# EasyEDA Pro project original-v2.epro, board PCB1
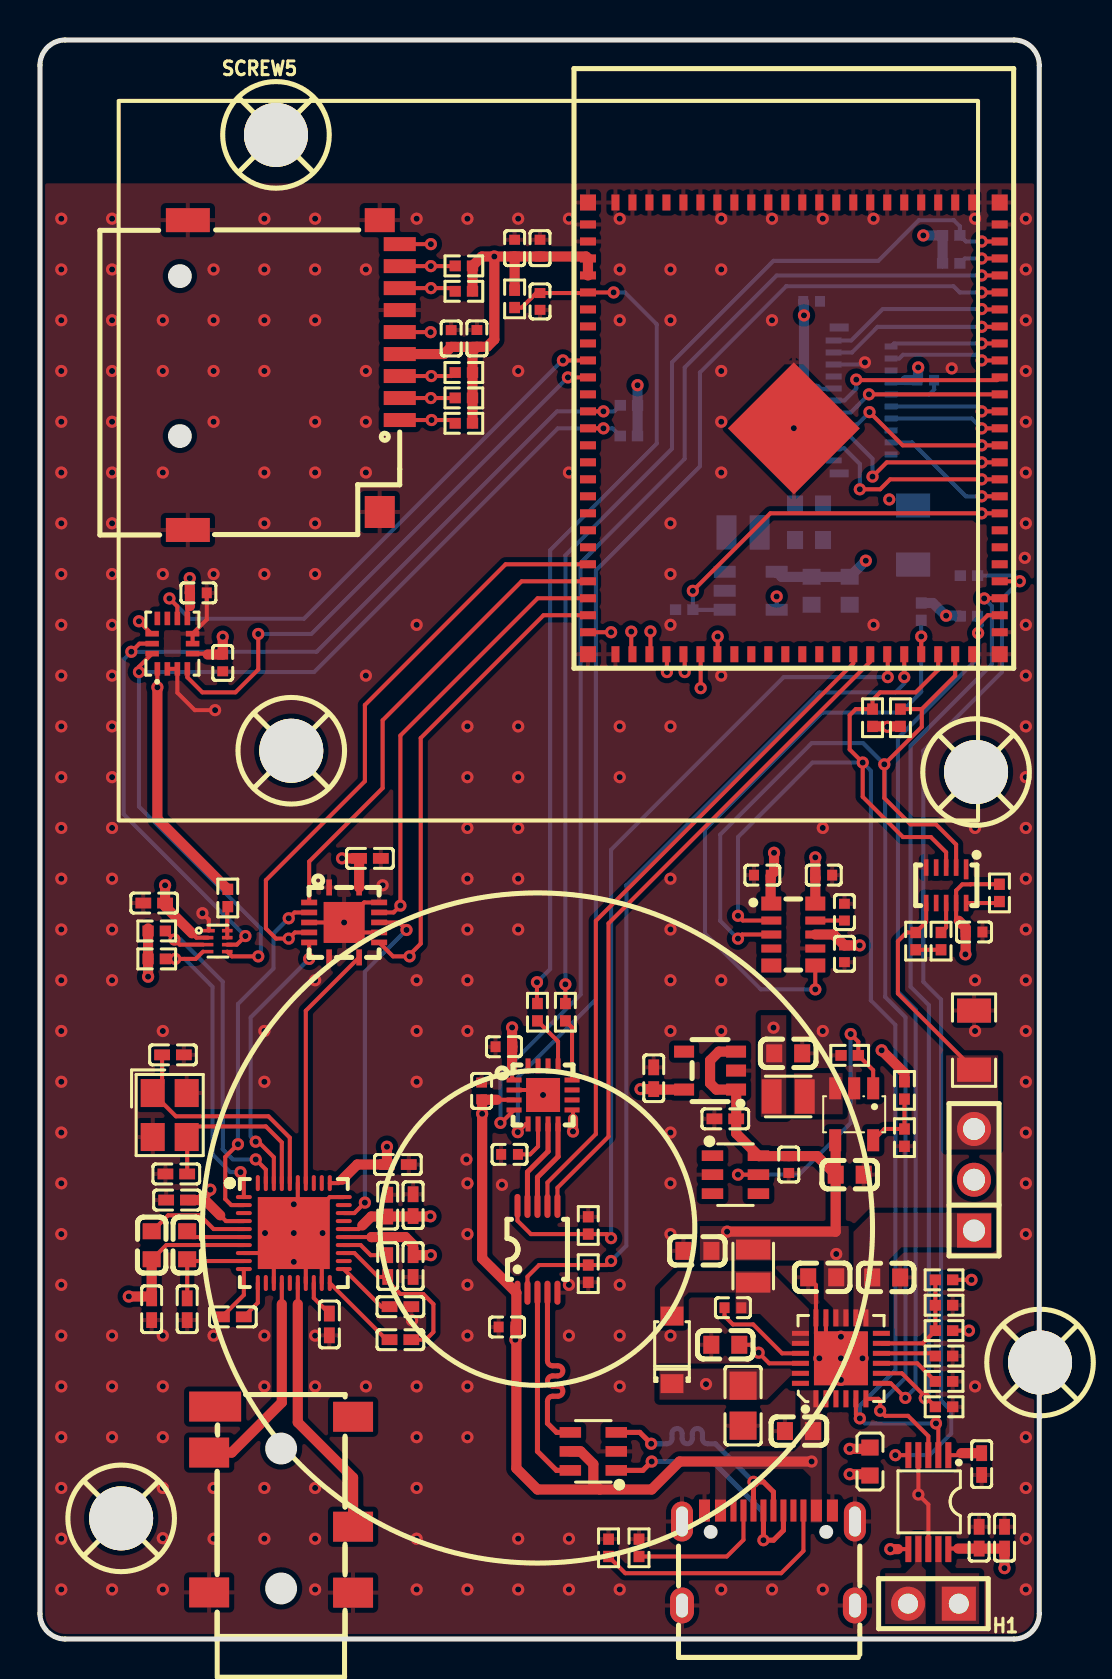
[diagram p9: board, top side]
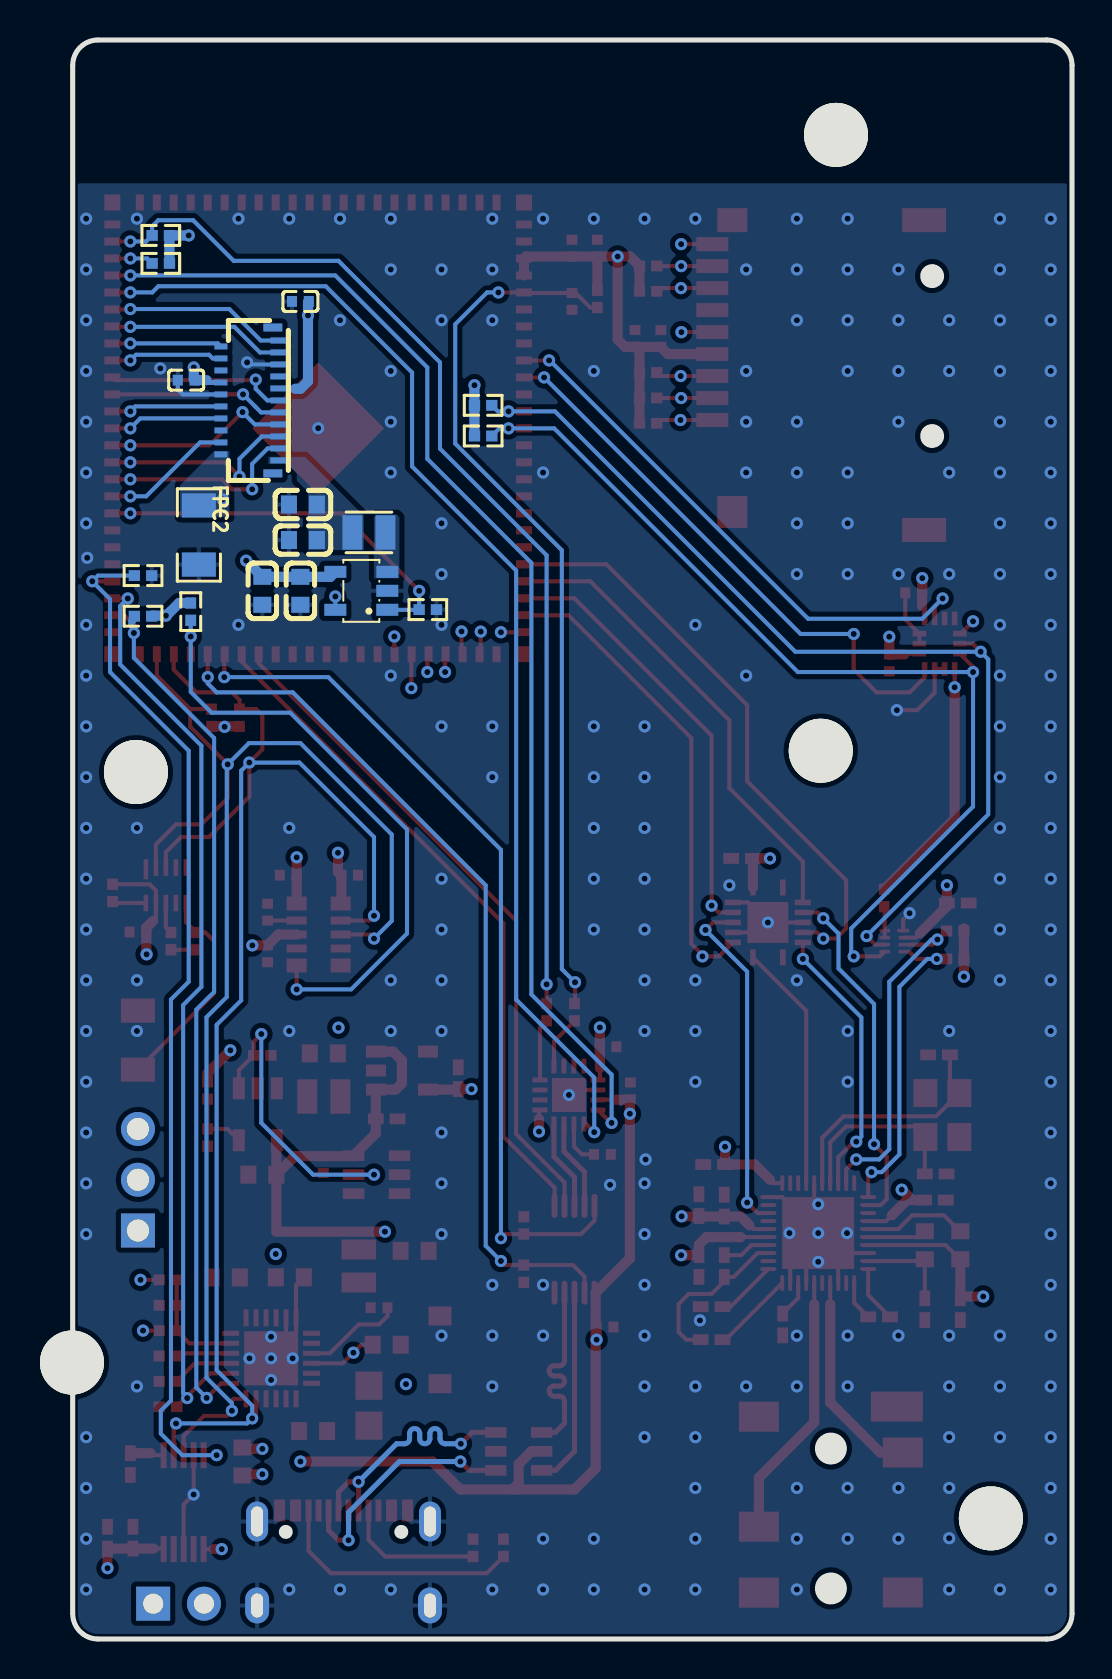
[diagram p10: board, bottom side, seen from below]

Outline 50 x 80 mm; copper layers: Top Layer, GND1, PWR, SINGAL, GND2, Bottom Layer. Coordinates in mm from the lower left corner of the outline.
Outline path: 0,78.73 0,1.27 arc(0.37,0.37) 1.27,0 48.73,0 arc(49.63,0.37) 50,1.27 50,78.73 arc(49.63,79.63) 48.73,80 1.27,80 arc(0.37,79.63) 0,78.73
Stack: Top Layer 0.035mm Outer layer thickness 1oz / Dielectric1 0.0994mm 3313 RC57% 4.2mil / GND1 0.035mm / Dielectric2 0.55mm 0.55mm H/H No copper / PWR 0.035mm / Dielectric3 0.1088mm 2116 RC54% 4.9mil / SINGAL 0.035mm / Dielectric4 0.55mm 0.55mm H/H No copper / GND2 0.035mm / Dielectric5 0.0994mm 3313 RC57% 4.2mil / Bottom Layer 0.035mm Outer layer thickness 1oz

## Design rules (mm)
net TYPEC_USB_DP_IN: USB1
net TYPEC_USB_DN_IN: USB1
net TYPEC_USB_DN: USB2
net TYPEC_USB_DP: USB2
net CH343P_USB_DP: USB3
net CH343P_USB_DN: USB3
spacing copperThickness1oz (default): track to track 0.102, other pairs 0.152 to 0.3
spacing copperThickness2oz: track to track 0.203, other pairs 0.152 to 0.3
track width copperThickness1oz (default): min 0.127, default 0.203, max 2.54
track width copperThickness2oz: min 0.203, default 0.254, max 2.54
track width power: min 0.127, default 0.508, max 2.54
differential pair differentialPair (default): width min 0.127, default 0.254, max 2.54; gap min 0.152, default 0.152
net GND uses copperRegion
net VBAT uses power
net VCC uses power
net VCC_3V3 uses power
net VCC_1V8 uses power
net VBUS_5V uses power

## Placement (name value [footprint] x y rotation side)
C1  10uF  [C0603_1]  40.51 23.23 180 top
C2  10uF  [C0603_1]  37.44 29.3 180 top
C3  100nF  [C0402]  37.47 23.74 90 top
C4  1uF  [C0402_1]  47.12 8.75 90 top
C5  1uF  [C0402_1]  46.99 5.07 270 top
C6  100nF  [C0402]  36.14 38.22 180 top
C7  100nF  [C0402]  39.22 38.22 0 top
C8  22uF  [C0603]  5.59 19.7 270 top
C9  4.7uF  [C0603_1]  34.29 14.72 180 top
C10  10uF  [C0603_1]  42.34 18.09 180 top
C11  47nF  [C0402]  34.67 16.58 0 top
C12  10uF  [C0603_1]  32.89 19.42 0 top
C14  1uF  [C0603_1]  37.97 10.4 0 top
C15  10uF  [C0603_1]  39.14 18.1 0 top
C16  47uF  [C0805]  35.18 11.67 270 top
C17  2.2uF  [C0402_1]  5.59 16.5 270 top
C18  22uF  [C0603]  7.37 19.7 270 top
C19  2.2uF  [C0402_1]  7.37 16.5 270 top
C20  2.2uF  [C0402_1]  9.65 16.12 0 top
C21  2.2uF  [C0402_1]  18.03 16.63 0 top
C22  2.2uF  [C0402_1]  14.48 15.74 270 top
C23  2.2uF  [C0402_1]  18.67 18.66 90 top
C24  2.2uF  [C0402_1]  17.4 18.66 270 top
C25  2.2uF  [C0402_1]  18.03 14.98 0 top
C26  4.7uF  [C0402_1]  17.4 21.68 90 top
C27  100nF  [C0402_1]  17.91 23.74 0 top
C28  100nF  [C0402_1]  6.86 21.96 180 top
C29  100nF  [C0402_1]  18.67 21.71 90 top
C30  1uF  [C0402_1]  34.29 26.02 0 top
C31  1uF  [C0402_1]  30.71 28.06 270 top
C32  10pF  [C0402_1]  6.66 29.23 180 top
C33  10pF  [C0402_1]  6.82 23.27 180 top
C34  100nF  [C0402_1]  5.72 36.82 180 top
C35  100nF  [C0402_1]  16.51 39.05 180 top
C36  100nF  [C0402]  23.37 15.61 180 top
C37  100nF  [C0402]  23.22 29.63 180 top
C38  100nF  [C0402]  23.5 24.25 180 top
C39  1uF  [C0402]  25.02 66.92 270 top
C40  100nF  [C0402]  25.02 69.59 90 top
C41  1uF  [C0402]  23.75 69.59 90 top
C42  10uF  [C0603_1]  38.48 56.76 180 bottom
C43  220nF  [C0402]  46.74 35.37 0 top
C44  100nF  [C0402]  22.1 27.42 90 top
C45  100nF  [C0402]  44.32 62.98 0 bottom
C46  100nF  [C0402]  38.61 66.92 0 bottom
C47  100nF  [C0402]  9.14 48.83 270 top
C48  100nF  [C0402]  7.93 52.34 0 top
C49  10uF  [C0402]  20.57 65.06 270 top
C50  100nF  [C0402]  21.86 65.07 270 top
C53  100nF  [C0402]  40.25 34.28 270 top
C54  1uF  [C0402]  40.25 36.37 90 top
C55  10uF  [C0603_1]  38.48 54.98 180 bottom
C56  10uF  [C0603_1]  40.51 52.44 90 bottom
C57  10uF  [C0603_1]  38.61 52.44 90 bottom
C58  100nF  [C0402_1]  48.26 5.07 270 top
CARD2  TF PUSH  [TF-SMD_TF-PUSH]  12.7 63.24 270 top
CN1  PJ-342B-TX-SMT  [AUDIO-SMD_PJ-342B-TX-SMT]  12.06 6.97 90 top
D1  USBLC6-2SC6  [SOT-23-6_L2.9-W1.6-P0.95-LS2.8-BL]  27.69 9.39 90 top
D2  B5817W  [SOD-123_L2.8-W1.8-LS3.7-RD]  31.62 14.47 90 top
FPC2  2.09寸320*375高清R角方屏QSPI  [CONN-TH-21P_AFE03-S21FMA-1H]  41.15 61.97 90 bottom
H1  -  [HDR-TH_2P-P2.54-V-F]  44.7 1.77 180 top
H2  -  [HDR-TH_3P-P2.54-V-M]  46.74 22.98 90 top
L1  2.2uH  [IND-SMD_L2.0-W1.6]  37.44 27.14 0 top
L2  2.2uH  [IND-SMD_L2.0-W1.6]  35.69 18.66 270 top
L3  BLM18KG601SN1D  [L0603]  41.53 8.88 90 top
L4  4.7uH  [IND-SMD_L2.0-W1.6]  35.18 55.36 180 bottom
R1  10mΩ  [R1206]  46.74 29.96 90 top
R2  1K  [R0402]  48.01 37.33 90 top
R3  22K1  [R0402]  43.25 25.08 90 top
R4  100K  [R0402]  43.25 27.45 90 top
R5  100K  [R0402]  40.51 29.2 0 top
R7  10K  [R0402]  41.66 46.09 90 top
R8  10K  [R0402]  43.05 46.09 90 top
R9  700R  [R0402]  45.23 14.16 180 top
R10  0R/NC  [R0402]  45.23 17.97 180 top
R11  100K  [R0402]  45.23 12.89 180 top
R12  100K  [R0402]  45.23 11.62 180 top
R13  5K23  [R0402]  45.23 15.43 180 top
R14  30K1  [R0402]  45.23 16.7 180 top
R17  200K  [R0402_2]  9.4 37.07 90 top
R18  10K  [R0402_1]  5.84 35.42 180 top
R19  10K  [R0402_1]  5.84 34.03 180 top
R20  10K  [R0402]  45.59 70.22 0 bottom
R21  100K  [R0402]  27.43 20.69 270 top
R22  100K  [R0402]  27.43 18.28 270 top
R25  10K  [R0402]  45.59 68.82 0 bottom
R26  10K  [R0402]  29.47 61.72 180 bottom
R27  0/NC  [R0402]  24.89 31.36 90 top
R28  0/NC  [R0402]  26.29 31.36 270 top
R29  10K  [R0402]  23.75 67.05 90 top
R30  10K  [R0402]  29.46 60.19 180 bottom
R31  5K1  [R0402]  29.97 4.56 270 top
R32  5K1  [R0402]  28.45 4.56 270 top
R33  1K  [R0402]  45.09 34.91 270 top
R34  0R/NC  [R0402]  43.81 34.91 270 top
R35  10K  [R0402]  21.21 68.7 180 top
R36  10K  [R0402]  21.21 60.82 180 top
R37  10K  [R0402]  21.21 62.09 180 top
R38  10K  [R0402]  21.21 67.43 180 top
R39  10K  [R0402]  21.21 63.36 180 top
R40  1R5  [R1206]  43.69 55.23 90 bottom
R41  100K  [R0402]  32.23 51.5 0 bottom
R42  10K  [R0402]  44.09 51.4 90 bottom
R43  10K  [R0402]  46.48 51.17 0 bottom
R44  10K  [R0402]  46.48 53.2 0 bottom
SCREW1  -  [M3螺丝]  4.06 6.04 0 top
SCREW2  -  [M3螺丝]  12.57 44.44 0 top
SCREW3  -  [M3螺丝]  50.04 13.83 0 top
SCREW4  -  [M3螺丝]  46.84 43.37 0 top
SCREW5  -  [M3螺丝]  11.81 75.25 0 top
U1  RX8130CE:BB  [RTC-SMD_L3.2-W2.5-P0.7-RX8130CE]  37.69 35.25 0 top
U2  CS43131-CNZ  [QFN-40_L5.0-W5.0-P0.40-TL-EP3.6_1]  12.7 20.31 0 top
U3  BQ25895RTW  [WQFN-24_L4.0-W4.0-P0.50-TL-EP2.7]  40.07 14.04 90 top
U4  TLV62568DBVR  [SOT-23-5_L3.0-W1.7-P0.95-LS2.8-BR]  40.74 26.25 90 top
U5  ME6211C18M5G-N  [SOT-23-5_L3.0-W1.7-P0.95-LS2.8-BR_1]  33.53 28.44 0 top
U6  GEK100  [SOT-23-6_L2.9-W1.6-P0.95-LS2.8-BL-2]  34.8 23.23 270 top
U7  PCA9306DQER  [X2SON-8_L1.4-W1.0-P0.35-BL]  8.89 34.91 270 top
U8  SN74LV4T125RGYR  [VQFN-14_L3.5-W3.5-P0.50-BL-EP]  15.22 35.85 270 top
U9  ESP32-S31-WROOM-3-N16R16V  [CONN-SMD_ESP32-S31-WROOM-3]  37.72 60.57 0 top
U11  DRV2605LDGSR  [VSSOP-10_L3.0-W3.0-P0.50-LS4.9-BL]  44.45 6.85 180 top
U12  CH343P  [TQFN-16_L3.0-W3.0-P0.50-BL-EP1.7]  25.17 27.22 270 top
U14  STC3115AIQT  [DFN-10_L3.0-W2.0-P0.50-BL]  45.34 37.71 180 top
U15  LSM6DS3TR-C  [LGA-14_L3.0-W2.5-P0.50-TL]  6.62 49.8 90 top
U16  PAM2804AAB010  [SOT-23-5_L3.0-W1.7-P0.95-LS2.8-BR]  35.56 52.44 180 bottom
U17  SGM7229YMS10G/TR  [MSOP-10_L3.0-W3.0-P0.50-LS4.9-BL]  24.89 19.5 0 top
USB1  TYPE-C 16PIN 2MD(073)  [USB-C-SMD_TYPE-C-16PIN-2MD-073]  36.45 4.05 0 top
X1  26MHz  [CRYSTAL-SMD_4P-L3.2-W2.5-BL_1]  6.49 26.21 270 top

## Footprints (pads in the part's own frame, mm; a bottom-side part is the same pattern mirrored in y, then rotated)
AUDIO-SMD_PJ-342B-TX-SMT
  rect 1.5x2 smd: 2(-4.645,3.6) 3(2.355,3.6) 5(-4.655,-3.6) 6(-1.355,-3.6) 7(4.145,-3.6)
  rect 1.5x2.6 smd: 4(4.655,3.3)
C0402
  rect 0.5x0.54 smd: 1(-0.42,0) 2(0.42,0)
C0402_1
  rect 0.79x0.54 smd: 1(-0.545,0) 2(0.545,0)
C0603
  rect 0.8x0.9 smd: 1(-0.7,0) 2(0.7,0)
C0603_1
  rect 0.8x0.9 smd: 1(-0.7,0) 2(0.7,0)
C0805
  rect 1.41x1.35 smd: 1(-1,0) 2(1,0)
CONN-SMD_ESP32-S31-WROOM-3
  rect 0.8x0.4 smd: 1(-10.3,10.2) 2(-10.3,9.35) 3(-10.3,8.5) 4(-10.3,7.65) 5(-10.3,6.8) 6(-10.3,5.95) 7(-10.3,5.1) 8(-10.3,4.25) 9(-10.3,3.4) 10(-10.3,2.55) 11(-10.3,1.7) 12(-10.3,0.85) 13(-10.3,0) 14(-10.3,-0.85) 15(-10.3,-1.7) 16(-10.3,-2.55) 17(-10.3,-3.4) 18(-10.3,-4.25) 19(-10.3,-5.1) 20(-10.3,-5.95) 21(-10.3,-6.8) 22(-10.3,-7.65) 23(-10.3,-8.5) 24(-10.3,-9.35) 25(-10.3,-10.2) 48(10.3,-10.2) 49(10.3,-9.35) 50(10.3,-8.5) 51(10.3,-7.65) 52(10.3,-6.8) 53(10.3,-5.95) 54(10.3,-5.1) 55(10.3,-4.25) 56(10.3,-3.4) 57(10.3,-2.55) 58(10.3,-1.7) 59(10.3,-0.85) 60(10.3,0) 61(10.3,0.85) 62(10.3,1.7) 63(10.3,2.55) 64(10.3,3.4) 65(10.3,4.25) 66(10.3,5.1) 67(10.3,5.95) 68(10.3,6.8) 69(10.3,7.65) 70(10.3,8.5) 71(10.3,9.35) 72(10.3,10.2)
  rect 0.4x0.8 smd: 26(-8.925,-11.3) 27(-8.075,-11.3) 28(-7.225,-11.3) 29(-6.375,-11.3) 30(-5.525,-11.3) 31(-4.675,-11.3) 32(-3.825,-11.3) 33(-2.975,-11.3) 34(-2.125,-11.3) 35(-1.275,-11.3) 36(-0.425,-11.3) 37(0.425,-11.3) 38(1.275,-11.3) 39(2.125,-11.3) 40(2.975,-11.3) 41(3.825,-11.3) 42(4.675,-11.3) 43(5.525,-11.3) 44(6.375,-11.3) 45(7.225,-11.3) 46(8.075,-11.3) 47(8.925,-11.3) 73(8.925,11.3) 74(8.075,11.3) 75(7.225,11.3) 76(6.375,11.3) 77(5.525,11.3) 78(4.675,11.3) 79(3.825,11.3) 80(2.975,11.3) 81(2.125,11.3) 82(1.275,11.3) 83(0.425,11.3) 84(-0.425,11.3) 85(-1.275,11.3) 86(-2.125,11.3) 87(-2.975,11.3) 88(-3.825,11.3) 89(-4.675,11.3) 90(-5.525,11.3) 91(-6.375,11.3) 92(-7.225,11.3) 93(-8.075,11.3) 94(-8.925,11.3)
  custom 6.604x6.604 smd: 95(0,3.302)
  rect 0.8x0.8 smd: 96(-10.3,-11.3) 97(10.3,-11.3) 98(10.3,11.3) 99(-10.3,11.3)
CONN-TH-21P_AFE03-S21FMA-1H
  rect 0.3x0.8 smd: 1(-3,-1.438) 3(-2.4,-1.438) 5(-1.8,-1.438) 7(-1.2,-1.438) 9(-0.6,-1.438) 11(0,-1.438) 13(0.6,-1.438) 15(1.2,-1.438) 17(1.8,-1.438) 19(2.4,-1.438) 21(3,-1.438)
  rect 0.3x0.65 smd: 2(-2.7,1.438) 4(-2.1,1.438) 6(-1.5,1.438) 8(-0.9,1.438) 10(-0.3,1.438) 12(0.3,1.438) 14(0.9,1.438) 16(1.5,1.438) 18(2.1,1.438) 20(2.7,1.438)
  rect 0.4x0.95 smd: 22(3.65,-1.163) 23(-3.65,-1.163)
CRYSTAL-SMD_4P-L3.2-W2.5-BL_1
  rect 1.4x1.2 smd: 1(-1.1,-0.85) 2(1.1,-0.85) 3(1.1,0.85) 4(-1.1,0.85)
DFN-10_L3.0-W2.0-P0.50-BL
  rect 0.23x1 smd: 1(-1,-0.8)
  rect 0.23x0.825 smd: 2(-0.5,-0.887) 3(0,-0.887) 4(0.5,-0.887) 5(1,-0.887) 6(1,0.887) 7(0.5,0.887) 8(0,0.887) 9(-0.5,0.887) 10(-1,0.887)
HDR-TH_2P-P2.54-V-F
  rect 1.7x1.7 hole 1: 1(-1.27,0)
  round 1.7 hole 1: 2(1.27,0)
HDR-TH_3P-P2.54-V-M
  rect 1.7x1.7 hole 1.1: 1(-2.54,0)
  round 1.7 hole 1.1: 2(0,0) 3(2.54,0)
IND-SMD_L2.0-W1.6
  rect 1x1.72 smd: 1(0.828,0) 2(-0.828,0)
L0603
  rect 0.8x0.864 smd: 1(-0.7,0) 2(0.7,0)
LGA-14_L3.0-W2.5-P0.50-TL
  rect 0.675x0.28 smd: 1(-1.262,0.75) 2(-1.262,0.25) 3(-1.262,-0.25) 4(-1.262,-0.75) 8(1.262,-0.75) 9(1.262,-0.25) 10(1.262,0.25) 11(1.262,0.75)
  rect 0.28x0.675 smd: 5(-0.5,-1.012) 6(0,-1.012) 7(0.5,-1.012) 12(0.5,1.012) 13(0,1.012) 14(-0.5,1.012)
M3螺丝
  round 3.2 hole 3.2: 1(0,0)
MSOP-10_L3.0-W3.0-P0.50-LS4.9-BL
  oval 0.3x1.2 smd: 1(-1,-2.17) 2(-0.5,-2.17) 3(0,-2.17) 4(0.5,-2.17) 5(1,-2.17) 6(1,2.17) 7(0.5,2.17) 8(0,2.17) 9(-0.5,2.17) 10(-1,2.17)
QFN-40_L5.0-W5.0-P0.40-TL-EP3.6_1
  oval 0.8x0.2 smd: 1(-2.499,1.8) 2(-2.499,1.4) 3(-2.499,1) 4(-2.499,0.6) 5(-2.499,0.2) 6(-2.499,-0.2) 7(-2.499,-0.6) 8(-2.499,-1) 9(-2.499,-1.4) 10(-2.499,-1.8) 21(2.499,-1.8) 22(2.499,-1.4) 23(2.499,-1) 24(2.499,-0.6) 25(2.499,-0.2) 26(2.499,0.2) 27(2.499,0.6) 28(2.499,1) 29(2.499,1.4) 30(2.499,1.8)
  oval 0.2x0.8 smd: 11(-1.8,-2.499) 12(-1.4,-2.499) 13(-1,-2.499) 14(-0.6,-2.499) 15(-0.2,-2.499) 16(0.2,-2.499) 17(0.6,-2.499) 18(1,-2.499) 19(1.4,-2.499) 20(1.8,-2.499) 31(1.8,2.499) 32(1.4,2.499) 33(1,2.499) 34(0.6,2.499) 35(0.2,2.499) 36(-0.2,2.499) 37(-0.6,2.499) 38(-1,2.499) 39(-1.4,2.499) 40(-1.8,2.499)
  rect 3.6x3.6 smd: 41(0,0)
R0402
  rect 0.566x0.54 smd: 1(-0.433,0) 2(0.433,0)
R0402_1
  rect 0.566x0.54 smd: 1(-0.433,0) 2(0.433,0)
R0402_2
  rect 0.566x0.54 smd: 1(-0.433,0) 2(0.433,0)
R1206
  rect 1.208x1.701 smd: 1(-1.479,0) 2(1.479,0)
RTC-SMD_L3.2-W2.5-P0.7-RX8130CE
  rect 1x0.7 smd: 1(-1.1,1.55) 5(-1.1,-1.55) 6(1.1,-1.55) 10(1.1,1.55)
  rect 1x0.4 smd: 2(-1.1,0.7) 3(-1.1,0) 4(-1.1,-0.7) 7(1.1,-0.7) 8(1.1,0) 9(1.1,0.7)
SOD-123_L2.8-W1.8-LS3.7-RD
  rect 0.95x1.15 smd: 1(-1.692,0) 2(1.692,0)
SOT-23-5_L3.0-W1.7-P0.95-LS2.8-BR
  rect 1.1x0.6 smd: 1(1.3,-0.95) 2(1.3,0) 3(1.3,0.95) 4(-1.3,0.95) 5(-1.3,-0.95)
SOT-23-5_L3.0-W1.7-P0.95-LS2.8-BR_1
  rect 1x0.6 smd: 1(1.3,-0.95) 2(1.3,0) 3(1.3,0.95) 4(-1.3,0.95) 5(-1.3,-0.95)
SOT-23-6_L2.9-W1.6-P0.95-LS2.8-BL
  rect 0.532x1.072 smd: 1(-0.95,-1.149) 2(0,-1.149) 3(0.95,-1.149) 4(0.95,1.149) 5(0,1.149) 6(-0.95,1.149)
SOT-23-6_L2.9-W1.6-P0.95-LS2.8-BL-2
  rect 0.532x1.072 smd: 1(-0.95,-1.149) 2(0,-1.149) 3(0.95,-1.149) 4(0.95,1.149) 5(0,1.149) 6(-0.95,1.149)
TF-SMD_TF-PUSH
  rect 0.7x1.6 smd: 1(2.25,5.3) 2(1.15,5.3) 3(0.05,5.3) 4(-1.05,5.3) 5(-2.15,5.3) 6(-3.25,5.3) 7(-4.35,5.3) 8(-5.45,5.3) CD(-6.55,5.3)
  rect 1.2x1.5 smd: 10(-7.75,4.3)
  rect 1.2x2.2 smd: 11(-7.75,-5.3) 12(7.75,-5.3)
  rect 1.6x1.5 smd: 13(6.85,4.3)
TQFN-16_L3.0-W3.0-P0.50-BL-EP1.7
  rect 0.25x0.75 smd: 1(-0.749,-1.45) 2(-0.248,-1.45) 3(0.252,-1.45) 4(0.751,-1.45) 9(0.75,1.45) 10(0.25,1.45) 11(-0.25,1.45) 12(-0.749,1.45)
  rect 0.75x0.25 smd: 5(1.45,-0.75) 6(1.45,-0.25) 7(1.45,0.25) 8(1.45,0.75) 13(-1.45,0.75) 14(-1.45,0.25) 15(-1.45,-0.25) 16(-1.45,-0.75)
  rect 1.7x1.7 smd: 17(0.001,0)
USB-C-SMD_TYPE-C-16PIN-2MD-073
  oval 1.1x2 hole 0.6x1.5: 13(-4.325,1.825) 14(4.325,1.825)
  oval 1.2x1.8 hole 0.6x1.2: 13(-4.325,-2.375) 14(4.325,-2.375)
  rect 0.55x1.1 smd: A1B12(-3.2,2.375) A4B9(-2.4,2.375) B1A12(3.2,2.375) B4A9(2.4,2.375)
  rect 0.3x1.1 smd: A5(-1.25,2.375) A6(-0.25,2.375) A7(0.25,2.375) A8(1.25,2.375) B5(1.75,2.375) B6(0.75,2.375) B7(-0.75,2.375) B8(-1.75,2.375)
VQFN-14_L3.5-W3.5-P0.50-BL-EP
  rect 0.8x0.28 smd: 1(-1.75,-0.75) 7(1.75,-0.75) 8(1.75,0.75) 14(-1.75,0.75)
  rect 0.28x0.8 smd: 2(-0.999,-1.75) 3(-0.498,-1.75) 4(0.002,-1.75) 5(0.501,-1.75) 6(1.002,-1.75) 9(1,1.75) 10(0.5,1.75) 11(0,1.75) 12(-0.5,1.75) 13(-1,1.75)
  rect 2.05x2.05 smd: 15(0,0)
VSSOP-10_L3.0-W3.0-P0.50-LS4.9-BL
  rect 0.3x1.3 smd: 1(-1,-2.35) 2(-0.5,-2.35) 3(0,-2.35) 4(0.5,-2.35) 5(1,-2.35) 6(1,2.35) 7(0.5,2.35) 8(0,2.35) 9(-0.5,2.35) 10(-1,2.35)
WQFN-24_L4.0-W4.0-P0.50-TL-EP2.7
  rect 0.85x0.25 smd: 1(-2.025,1.25) 2(-2.025,0.75) 3(-2.025,0.25) 4(-2.025,-0.25) 5(-2.025,-0.75) 6(-2.025,-1.25) 13(2.025,-1.25) 14(2.025,-0.75) 15(2.025,-0.25) 16(2.025,0.25) 17(2.025,0.75) 18(2.025,1.25)
  rect 0.25x0.85 smd: 7(-1.25,-2.025) 8(-0.75,-2.025) 9(-0.25,-2.025) 10(0.25,-2.025) 11(0.75,-2.025) 12(1.25,-2.025) 19(1.25,2.025) 20(0.75,2.025) 21(0.25,2.025) 22(-0.25,2.025) 23(-0.75,2.025) 24(-1.25,2.025)
  rect 2.7x2.7 smd: 25(0.001,0)
X2SON-8_L1.4-W1.0-P0.35-BL
  rect 0.175x0.6 smd: 1(-0.525,-0.445)
  rect 0.175x0.53 smd: 2(-0.175,-0.48) 3(0.175,-0.48) 4(0.525,-0.48) 5(0.525,0.48) 6(0.175,0.48) 7(-0.175,0.48) 8(-0.525,0.48)

## Nets
As in the schematic, except:
$2N16: C9.1 R13.1 U3.22
$2N18: R10.2 R13.2 R14.2 U3.11

Pads without a net: CN1 4 7; FPC2 6 15 16 22 23; SCREW1 1; SCREW2 1; SCREW3 1; SCREW4 1; SCREW5 1; U1 4 5; U2 3 12 15 22 27 29 32 33 40; U5 4; U6 4; U9 6 7 8 33 34 35 36 37 38 39 52 53 54 91; U12 10 11 14 15 16; U14 4 7; U15 10 11; USB1 A8 B8

## Via types
v1: diameter 0.61, hole 0.305, Top Layer to Bottom Layer, 364 vias

## Routing (per net, layer and track width the routed paths; a pad name or vN(x,y) marks a point on that pad's centre or on a via; arc(x,y) is an arc through that point)
GND: length 43
  Top Layer w0.203: U2.13 11.7,19.31 U2.8 ; 12.9,20.51 v1(12.7,20.31) ; 12.9,20.51 14.5,22.11 U2.30 ; 12.9,20.51 U2.35 ; v1(8.13,36.31) 8.44,35.99 8.44,35.44 ; U15.2 U15.3 6.87,47.34 7.75,46.47 v1(8.76,46.47) ; v1(25.17,27.22) 24.92,27.47 U12.2 ; C15.1 38.82,17.71 U3.18 38.82,15.29 39.32,14.79 ; U15.6 U15.7 8.34,51.01 C48.2 ; U2.17 13.3,19.71 14.1,18.91 U2.19 ; 39.32,14.79 v1(40.08,14.04) ; 39.32,14.79 U3.17 ; U11.8 44.45,6.73 v1(43.95,7.23) U11.4 ; 13.47,35.85 v1(15.22,35.85) ; U8.13 16.22,36.85 U8.15 15.72,35.35 U8.10
  Bottom Layer w0.203: FPC2.17 41.17,63.77 v1(41.28,63.87) ; FPC2.12 44.5,62.27 44.74,62.51 44.74,62.85
  vias: v1(1.07,71.06) v1(1.07,68.52) v1(1.07,65.98) v1(1.07,63.44) v1(1.07,60.9) v1(1.07,58.36) v1(1.07,55.82) v1(1.07,53.28) v1(1.07,50.74) v1(1.07,48.2) v1(1.07,45.66) v1(1.07,43.12) v1(1.07,40.58) v1(1.07,38.04) v1(1.07,35.5) v1(1.07,32.96) v1(1.07,30.42) v1(1.07,27.88) v1(1.07,25.34) v1(1.07,22.8) v1(1.07,20.26) v1(1.07,17.72) v1(1.07,15.18) v1(1.07,12.64) v1(1.07,10.1) v1(1.07,7.56) v1(1.07,5.02) v1(1.07,2.48) v1(3.61,71.06) v1(3.61,68.52) v1(3.61,65.98) v1(3.61,63.44) v1(3.61,60.9) v1(3.61,58.36) v1(3.61,55.82) v1(3.61,53.28) v1(3.61,50.74) v1(3.61,48.2) v1(3.61,45.66) v1(3.61,43.12) v1(3.61,40.58) v1(3.61,38.04) v1(3.61,35.5) v1(3.61,32.96) v1(3.61,15.18) v1(3.61,12.64) v1(3.61,10.1) v1(3.61,2.48) v1(6.15,65.98) v1(6.15,63.44) v1(6.15,58.36) v1(6.15,53.28) v1(6.15,30.42) v1(6.15,15.18) v1(6.15,12.64) v1(6.15,10.1) v1(6.15,7.56) v1(6.15,5.04) v1(6.15,2.48) v1(8.69,68.52) v1(8.69,65.98) v1(8.69,63.44) v1(8.69,60.9) v1(8.69,53.28) v1(8.69,15.18) v1(8.69,7.56) v1(8.69,5.02) v1(11.23,71.06) v1(11.23,68.52) v1(11.23,65.98) v1(11.23,63.44) v1(11.23,58.36) v1(11.23,55.82) v1(11.23,53.28) v1(11.23,30.42) v1(11.23,27.88) v1(11.26,20.31) v1(11.23,15.18) v1(11.23,12.64) v1(11.23,7.56) v1(11.23,5.02) v1(12.7,21.75) v1(12.7,18.87) v1(13.77,71.06) v1(13.77,68.52) v1(13.77,65.98) v1(13.77,60.9) v1(13.77,58.36) v1(13.77,55.82) v1(13.77,53.28) v1(13.77,32.96) v1(13.77,15.18) v1(13.77,12.64) v1(13.77,7.56) v1(13.77,5.02) v1(13.77,2.48) v1(14.14,20.31) v1(16.31,68.52) v1(16.31,63.44) v1(16.31,60.9) v1(16.31,58.36) v1(16.31,48.2) v1(16.31,12.64) v1(17.15,37.71) v1(18.62,15.94) v1(18.85,71.06) v1(18.85,50.74) v1(18.85,32.96) v1(18.85,30.42) v1(18.85,27.88) v1(18.85,12.64) v1(18.85,10.1) v1(18.85,7.56) v1(18.85,5.02) v1(18.85,2.48) v1(21.34,23.99) v1(21.39,71.06) v1(21.39,45.66) v1(21.39,43.12) v1(21.39,40.58) v1(21.39,38.04) v1(21.39,35.5) v1(21.39,32.96) v1(21.39,30.42) v1(21.39,22.8) v1(21.39,20.26) v1(21.39,17.72) v1(21.39,15.18) v1(21.39,12.64) v1(21.39,10.1) v1(21.39,2.48) v1(23.11,22.72) v1(23.93,71.06) v1(23.93,63.44) v1(23.93,45.66) v1(23.93,43.12) v1(23.93,40.58) v1(23.93,38.04) v1(23.93,35.5) v1(23.93,5.02) v1(23.93,2.48) v1(26.47,71.06) v1(26.47,58.36) v1(26.47,17.72) v1(26.47,15.18) v1(26.47,5.02) v1(26.47,2.48) v1(29.01,71.06) v1(29.01,68.52) v1(29.01,65.98) v1(29.01,45.66) v1(29.01,43.12) v1(29.01,17.72) v1(29.01,15.18) v1(29.01,12.64) v1(29.01,2.48) v1(31.55,68.52) v1(31.55,65.98) v1(31.55,55.82) v1(31.55,53.28) v1(31.55,50.74) v1(31.55,45.66) v1(31.55,38.04) v1(31.55,35.5) v1(31.55,32.96) v1(31.55,30.42) v1(31.55,25.34) v1(31.55,22.8) v1(31.55,20.26) v1(31.55,15.18) v1(34.09,71.06) v1(34.09,68.52) v1(34.09,63.44) v1(34.09,60.9) v1(34.09,58.36) v1(34.09,48.2) v1(34.09,32.96) v1(34.09,30.42) v1(34.09,2.48) v1(36.63,71.06) v1(36.63,65.98) v1(36.63,2.48) v1(37.72,60.58) v1(39,14.04) v1(39.17,71.06) v1(39.17,40.58) v1(39.17,30.42) v1(39.17,2.48) v1(40.08,15.12) v1(40.07,12.96) v1(41.16,14.04) v1(41.71,71.06) v1(41.71,50.74) v1(45.62,63.57) v1(46.79,71.06) v1(46.79,40.58) v1(46.79,32.96) v1(46.79,30.42) v1(46.79,12.64) v1(49.33,71.06) v1(49.33,68.52) v1(49.33,65.98) v1(49.33,63.44) v1(49.33,60.9) v1(49.33,58.36) v1(49.33,55.82) v1(49.28,54.09) v1(49.33,50.74) v1(49.33,48.2) v1(49.33,45.66) v1(49.33,43.12) v1(49.33,40.58) v1(49.33,38.04) v1(49.33,35.5) v1(49.33,32.96) v1(49.33,30.42) v1(49.33,27.88) v1(49.33,25.34) v1(49.33,22.8) v1(49.33,20.26) v1(49.33,10.1) v1(49.33,7.56) v1(49.33,5.02) v1(49.33,2.48)
VBAT: length 33.6
  Top Layer w0.203: R2.2 46.56,37.76 46.56,37.76 46.15,37.76 45.84,37.45 U14.9 45.84,36.07 45.97,35.93
  Top Layer w0.508: 45.97,35.93 46.32,35.59 46.32,35.42 ; C43.1 46.32,34.27 v1(46.3,34.25) ; 38.79,38.05 v1(38.79,39.11) ; 38.79,38.05 U1.10 ; 38.79,38.05 38.81,38.07
  PWR w0.508: 44.45,32.4 44.45,33.45 v1(38.79,39.11) ; 44.45,32.4 44.45,20.94 44.96,20.44 H2.1 ; 44.45,32.4 v1(46.3,34.25)
VBUS_5V: length 47.7
  Top Layer w0.203: U12.9 26.67,26.42 26.67,26.02 ; 22.86,26.98 23.71,26.98 U12.3
  Top Layer w0.508: 28,7.48 24.89,7.48 23.84,8.54 23.84,17.33 22.12,19.04 v1(22.12,26.28) 22.12,26.98 22.86,26.98 ; 28,7.48 27.69,7.8 27.69,8.75 27.05,9.39 D1.5 ; 28,7.48 30.61,7.48 32,8.88 v1(38.61,8.88) ; 26.67,26.02 v1(26.67,25.39) ; C36.1 v1(23.79,14.98)
  PWR w0.508: v1(22.12,26.28) 22.12,24.98 22.73,24.37 25.78,24.37 26.67,25.26 v1(26.67,25.39)
VCC: length 41.9
  Top Layer w0.203: 16.13,20.69 15.95,20.51 U2.26
  Top Layer w0.508: C1.2 39.81,20.38 v1(34.38,20.38) ; C1.2 38.88,24.16 C3.2 35.97,24.16 U6.6 34.84,25.29 C30.2 34.84,27.48 U5.1 33.84,27.49 33.53,27.8 33.53,28.95 33.97,29.39 U5.3 ; C1.2 39.81,24.93 U4.4 ; 16.13,20.69 16.57,21.14 C26.1 19.52,21.14 v1(19.53,21.15)
  PWR w0.508: v1(19.53,21.15) 33.61,21.15 v1(34.38,20.38)
  vias: v1(39.84,19.26)
VCC_1V8: length 109.8
  Top Layer w0.203: 7.61,35.31 7.83,35.09 U7.2 ; 5.59,18.97 6.32,19.71 U2.7 ; 15.11,22.98 14.95,22.81 U2.31 ; U2.25 16.59,20.11 ; 9.02,21.2 9.31,20.91 U2.4
  Top Layer w0.508: v1(4.45,17.13) 5.5,17.13 C17.1 5.59,18.97 ; 7.61,35.31 6.26,36.66 C34.1 v1(6.26,37.71) ; 16.59,20.11 16.59,20.11 18.29,20.11 18.67,19.73 C23.2 v1(19.56,19.2) ; 15.11,22.98 15.88,23.74 C27.1 v1(17.36,24.63) ; 8,21.96 8.25,21.96 9.02,21.2 ; 8,21.96 v1(8.52,22.48) ; 8,21.96 C28.1 ; v1(30.05,27.51) C31.2 30.73,27.49 U5.5 ; 5.41,33.14 5.41,35.55 ; v1(15.11,39.05) C35.2 15.97,39.05 U8.14
  PWR w0.508: v1(8.52,22.48) 15.22,22.48 v1(17.36,24.63) ; v1(15.11,39.05) 7.61,39.05 v1(6.26,37.71) 5.41,36.86 v1(5.41,33.14) 4.01,31.74 4.01,17.57 v1(4.45,17.13) 12.95,17.13 15.14,19.33 ; v1(19.56,19.2) 15.27,19.2 15.14,19.33 ; v1(17.36,24.63) 21.3,28.56 29,28.56 v1(30.05,27.51) ; v1(17.36,24.63) 17.36,21.54 15.14,19.33
VCC_3V3: length 229.1
  Top Layer w0.203: U15.5 8.25,49.3 ; v1(4.95,50.92) 5.57,50.3 U15.12 ; U15.8 7.37,51.55 7.5,51.68 ; 23.62,28.56 23.62,28.07 U12.1 ; U15.1 v1(5.87,47.61)
  Top Layer w0.508: v1(36.73,39.33) 36.73,38.38 C6.1 ; U1.1 36.56,36.83 36.56,38.14 ; v1(7.49,53.08) 7.49,52.35 7.5,52.34 7.5,51.68 ; 23.62,29.62 v1(23.62,30.6) ; 23.62,29.62 C37.1 ; 23.62,29.62 23.62,28.56 ; R7.1 R8.1 ; U9.4 U9.3 27.32,69.17 C40.1 C41.1 ; v1(22.73,69.17) 22.11,69.17 R35.1 R38.1 ; v1(22.73,69.17) C41.1 ; v1(22.73,69.17) 22.73,65.01 22.37,64.65 C50.2 ; CARD2.4 20.22,64.29 C49.2 21.86,64.64 21.64,64.43 R39.1 R37.1 R36.1 ; 8.39,49.25 C47.1 v1(9.14,50.14) ; R4.2 43.25,28.31 v1(42.11,29.45) ; U1.8 39.71,35.25 C53.1 v1(41.01,34.7) ; v1(5.87,47.61) 5.87,41.03 R17.2 ; C41.1 R29.2
  PWR w0.508: v1(22.73,69.17) 23.46,69.17 v1(29.9,62.73) ; v1(22.73,69.17) 20.1,66.54 16.26,66.54 7.49,57.77 v1(7.49,53.08) 7.49,51.62 5.87,50 ; v1(22.73,69.17) 23.79,70.22 v1(44.2,70.22) 44.2,68.95 41.47,66.22 41.34,66.22 ; 5.87,50 v1(4.95,50.92) ; 5.87,50 v1(5.87,47.61) ; v1(42.11,29.45) 42.11,33.6 v1(41.01,34.7) 36.73,38.99 v1(36.73,39.33) 36.7,39.31 ; 41.34,66.22 v1(38.23,66.22) ; 41.34,66.22 v1(43.94,63.62) 45.38,62.18 45.38,46.17 43.56,46.17 43.03,45.64 v1(42.4,45.64) 38.54,45.64 36.7,43.8 36.7,39.31 ; v1(36.7,30.59) 36.7,39.31 ; v1(5.87,47.61) 5.87,43.77 8.38,41.26 16.76,41.26 23.62,34.41 v1(23.62,30.6) ; v1(5.87,47.61) 6.62,47.61 v1(9.14,50.14)
  Bottom Layer w0.203: 38.86,62.55 39.69,62.55 FPC2.13
  Bottom Layer w0.254: 43.31,62.98 43.19,62.87 FPC2.14
  Bottom Layer w0.508: R25.1 R20.1 v1(44.2,70.22) ; C46.1 38.23,66.88 v1(38.23,66.22) 38.23,62.93 38.6,62.55 38.86,62.55 ; R30.1 29.9,60.19 R26.1 v1(29.9,62.73) ; R42.2 44.68,51.83 45.31,51.2 v1(45.34,51.2) 46.02,51.2 R43.1 ; 43.31,62.98 43.9,62.98 43.94,63.02 v1(43.94,63.62)
VCC_LCD_BG: length 61.4
  Top Layer w0.508: v1(40.51,9.51) 41.46,9.51 L3.2
  PWR w0.508: v1(41.32,53.95) 32.89,45.52 32.89,30.34 35.81,27.42 35.81,16.63 33.33,14.14 v1(33.33,12.75) 35.8,10.28 39.75,10.28 v1(40.51,9.51)
  Bottom Layer w0.508: U16.4 37.11,53.14 C57.2 C56.2 v1(41.32,53.95)
BAT_TS: length 8.6
  Top Layer w0.203: R10.1 v1(46.61,17.97)
  SINGAL w0.203: H2.2 45.97,22.98 44.83,21.83 44.83,18.53 45.39,17.97 v1(46.61,17.97)
BQ25895_CHG_EN#: length 3.1
  Top Layer w0.203: R11.2 43.9,13.79 U3.9
BQ25895_I2C_CLK: length 71.2
  Top Layer w0.203: v1(44.83,10.78) 44.95,10.67 U11.2 ; U3.5 40.82,11.23 v1(41.02,11.04) ; U1.2 35.16,35.95 v1(34.93,36.18) ; U9.45 44.94,48.49 43.81,47.36 42.04,47.36 41.66,46.98 R7.2 40.82,46.52 40.51,46.22 40.51,44.5 v1(41.16,43.85) 41.16,42.14 43.18,40.12 44.58,40.12 45.34,39.36 U14.3
  Bottom Layer w0.203: v1(44.83,10.78) 41.28,10.78 v1(41.02,11.04) 41.02,11.67 42.8,13.45 42.8,30.72 41.57,31.95 41.57,43.44 v1(41.16,43.85) 38.65,43.85 34.93,40.12 v1(34.93,36.18)
BQ25895_I2C_SDA: length 71.8
  Top Layer w0.203: v1(34.93,35.04) 35.13,35.25 U1.3 ; U3.6 41.95,12.02 42.04,11.93 v1(42.04,11.42) 42.29,11.17 43.43,11.17 44.45,10.15 U11.3 ; R8.2 44.12,46.52 ; 44.12,46.52 44.12,45.63 v1(42.25,43.76) 42.25,42.07 43.56,40.76 44.83,40.76 45.84,39.75 U14.2 ; 44.12,46.52 45.79,48.2 U9.46
  Bottom Layer w0.203: v1(34.93,35.04) 34.04,35.93 34.04,40.25 38.61,44.82 41.19,44.82 v1(42.25,43.76) 42.29,43.71 42.29,32.12 43.31,31.1 43.31,13.07 42.04,11.8 v1(42.04,11.42)
BQ25895_INT: length 44.8
  Top Layer w0.203: U9.49 47.42,51.22 46.94,50.74 v1(46.94,50.33) ; v1(43.3,12.06) 42.57,12.79 U3.7
  Bottom Layer w0.203: 47.04,51.04 47.12,50.97 47.12,50.71 ; 47.12,50.71 46.91,50.92 ; 47.12,50.71 46.94,50.54 v1(46.94,50.33) 46.94,49.09 42.93,45.07 42.93,32.37 43.81,31.49 43.81,12.58 v1(43.3,12.06)
BQ25895_OTG_EN: length 46.5
  Top Layer w0.203: v1(47.24,52.06) 47.25,52.07 U9.50 ; R12.2 43.13,13.29 U3.8
  Bottom Layer w0.203: v1(44.27,12.05) 44.27,12.09 44.48,12.29 44.48,31.71 43.56,32.63 43.56,44.69 47.62,48.76 47.62,51.68 v1(47.24,52.06)
CH343P_UART_DTR: length 3.1
  Top Layer w0.203: U12.12 26.62,30.59 R28.2
CH343P_UART_RTS: length 2.7
  Top Layer w0.203: U12.13 25.92,29.9 R27.1
CH343P_UART_RX: length 59.4
  Top Layer w0.203: U12.5 24.32,25.77 v1(23.91,25.36) ; U9.68 v1(47.12,67.37)
  Bottom Layer w0.203: v1(47.12,67.37) 46.02,67.37 45.71,67.68 37.34,67.68 33.02,63.36 33.02,58.66 27.81,53.46 27.81,31.99 23.91,28.09 v1(23.91,25.36)
CH343P_UART_TX: length 60.2
  Top Layer w0.203: U9.69 v1(47.12,68.22) ; v1(23.04,25.82) 23.08,25.82 U12.4
  Bottom Layer w0.203: v1(23.04,25.82) 23.04,28.23 27.05,32.25 27.05,53.84 32.26,59.04 32.26,63.62 36.86,68.22 v1(47.12,68.22)
CH343P_USB_DN: length 4.5
  Top Layer w0.254: U12.8 25.92,24.13 24.89,23.1 U17.8
CH343P_USB_DP: length 4.5
  Top Layer w0.254: U17.9 24.39,23.37 25.42,24.4 U12.7
CS43131_I2S_LRCK: length 13.8
  Top Layer w0.203: U2.38 11.7,24.1 10.92,24.88 v1(10.79,24.88) ; U8.6 v1(13.47,34.03)
  Bottom Layer w0.203: v1(13.47,34.03) 10.54,31.1 10.54,25.14 v1(10.79,24.88)
CS43131_I2S_SCLK: length 12.4
  Top Layer w0.203: U8.8 13.3,31.43 U2.34
CS43131_I2S_SDIN: length 17.6
  Top Layer w0.203: U2.2 9.57,21.71 9.27,22.01 9.27,24.12 v1(9.91,24.75) ; 13.47,36.35 12.74,36.35 v1(12.45,36.06)
  Bottom Layer w0.203: v1(12.45,36.06) 11.68,35.3 11.68,33.55 9.91,31.77 v1(9.91,24.75)
CS43131_RST#_1V8: length 17.3
  Top Layer w0.203: v1(18.34,35.47) 17.96,35.85 U8.11 ; v1(16.26,21.83) 15.73,21.31 U2.28
  Bottom Layer w0.203: v1(16.26,21.83) 16.26,33.39 v1(18.34,35.47)
CS43131_SCL_1V8: length 17.1
  Top Layer w0.203: 8.16,34.74 6.99,34.74 v1(6.73,34.99) 6.7,34.99 R18.1 ; U2.39 11.3,23.49 v1(10.79,23.99)
  Bottom Layer w0.203: v1(6.73,34.99) 7.03,34.99 9.14,32.88 9.14,24.5 9.65,23.99 v1(10.79,23.99)
CS43131_SDA_1V8: length 15.9
  Top Layer w0.203: U2.1 10.2,23.19 v1(10.03,23.36) ; 8.16,34.39 7.79,34.03 v1(6.77,34.03) R19.1
  Bottom Layer w0.203: v1(6.77,34.03) 7.24,34.03 8.64,32.63 8.64,24.25 9.53,23.36 v1(10.03,23.36)
DAC_I2C_SCL: length 49.5
  Top Layer w0.203: v1(4.57,49.39) 4.98,49.8 U15.13 ; v1(10.28,35.17) 9.85,34.74 U7.6 ; 27.42,61.42 v1(28.19,61.42)
  Bottom Layer w0.203: R26.2 28.73,61.42 v1(28.19,61.42) 25.87,61.42 13.84,49.39 v1(4.57,49.39) 4.19,49.01 4.19,41.26 v1(10.28,35.17)
DAC_I2C_SDA: length 49.7
  Top Layer w0.203: U15.14 4.95,48.64 v1(4.95,48.38) ; U9.13 v1(28.19,60.57) ; U7.5 9.61,34.15 v1(10.92,34.15)
  Bottom Layer w0.203: v1(10.92,34.15) 11.05,34.28 11.05,35.55 4.95,41.65 v1(4.95,48.38) 13.72,48.38 25.91,60.57 v1(28.19,60.57) 28.65,60.57 R30.2
DAC_I2S_LRCK: length 29.8
  Top Layer w0.203: U9.21 23.3,53.77 16.26,46.73 16.26,42.92 11.3,37.96 11.3,35.55 11.81,35.04 v1(12.45,35.04) 12.75,35.35 13.47,35.35
DAC_I2S_SCLK: length 23.9
  Top Layer w0.203: U8.9 17.67,34.15 v1(18.49,34.15) 18.49,34.23 19.05,34.79 19.05,45.07 25.19,51.22 U9.24
DAC_I2S_SDIN: length 23.8
  Top Layer w0.203: 13.47,36.85 13.47,38.89 17.15,42.57 17.15,45.96 24.1,52.92 27.42,52.92
DAC_RST#: length 21.9
  Top Layer w0.203: U9.23 24.9,52.07 18.03,45.2 v1(18.03,36.69) 17.69,36.35 U8.12
ESP32S31_EN: length 44.6
  Top Layer w0.203: v1(28.7,67.37) U9.5 27.39,67.34 24.83,67.34 24.1,66.61 R29.1 ; R27.2 24.87,31.82 v1(24.87,32.86)
  Bottom Layer w0.203: v1(28.7,67.37) 29.27,67.37 30.86,65.78 30.86,59.81 25.53,54.47 25.53,33.52 v1(24.87,32.86)
ESP_BOOT1: length 54.3
  Top Layer w0.203: R28.1 v1(26.29,32.76) ; 48.02,69.92 v1(47.12,69.92)
  Bottom Layer w0.203: v1(47.12,69.92) 46.33,69.92 R20.2 46.03,70.68 45.72,70.98 43.98,70.98 41.94,68.95 36.7,68.95 31.62,63.87 31.62,59.55 26.29,54.22 v1(26.29,32.76)
ESP_BOOT2: length 2.1
  Top Layer w0.203: U9.70 v1(47.12,69.07)
  Bottom Layer w0.203: R25.2 46.27,69.07 v1(47.12,69.07)
ESP_I2C2_SCL: length 8.8
  Top Layer w0.203: U9.66 48,65.65 v1(47.12,65.65)
  Bottom Layer w0.203: v1(47.12,65.65) 41.91,65.65 40.63,64.37 FPC2.19
ESP_I2C2_SDA: length 5.5
  Top Layer w0.203: U9.65 v1(47.12,64.82)
  Bottom Layer w0.203: v1(47.12,64.82) 42.74,64.82 FPC2.20
ESP_IO1: length 27.9
  Top Layer w0.203: U9.9 v1(26.17,63.97) ; U15.9 6.87,51.66 v1(6.48,52.06)
  Bottom Layer w0.203: v1(26.17,63.97) 26.13,63.97 13.21,51.04 7.49,51.04 v1(6.48,52.06)
ESP_IO4: length 28.3
  Top Layer w0.203: v1(10.92,50.28) 10.92,48.5 9.78,47.36 8.13,47.36 7.37,48.11 U15.4 ; U9.10 v1(26.42,63.12)
  Bottom Layer w0.203: v1(10.92,50.28) 13.58,50.28 v1(26.42,63.12)
ESP_IO19: length 26.5
  Top Layer w0.203: U9.25 v1(28.57,50.37) ; CARD2.CD v1(19.56,69.79)
  SINGAL w0.203: v1(28.57,50.37) 21.34,57.61 21.34,64.76 18.8,67.3 18.8,69.02 v1(19.56,69.79)
ESP_IO33: length 43.8
  Top Layer w0.203: U17.10 23.89,20.93 24.56,20.26 R21.2 28.37,20.26 v1(28.57,20.06) ; U9.42 42.42,49.24 v1(42.42,48.12)
  Bottom Layer w0.203: v1(28.57,20.06) 28.57,39.49 37.21,48.12 v1(42.42,48.12)
ESP_IO34: length 44
  Top Layer w0.203: 24.39,17.33 24.39,18.13 24.97,18.71 R22.1 28.37,18.71 v1(28.57,18.91) ; U9.43 v1(43.24,48.12)
  Bottom Layer w0.203: v1(28.57,18.91) 29.34,19.67 29.34,37.71 38.99,47.36 42.8,47.36 43.24,47.81 v1(43.24,48.12)
ESP_IO35: length 31.2
  Top Layer w0.203: U1.6 v1(38.79,32.5) ; U9.44 v1(44.09,50.15)
  Bottom Layer w0.203: 44.09,50.97 v1(44.09,50.16) 44.09,47.39 43.05,46.34 39.12,46.34 33.27,40.5 33.27,35.3 36.07,32.5 v1(38.79,32.5)
ESP_IO40: length 52.3
  Top Layer w0.203: 48.02,52.92 v1(49.02,52.92) ; U11.5 v1(42.8,9.2)
  Bottom Layer w0.203: v1(42.8,9.2) 44.51,9.2 45.59,10.28 45.59,11.42 45.09,11.93 45.09,31.99 44.2,32.88 44.2,44.44 48.13,48.38 48.13,52.03 v1(49.02,52.92) 48.74,53.2 R44.2
ESP_IO45: length 19.5
  Top Layer w0.203: U9.55 v1(47.12,56.32) 36.54,56.32 v1(32.67,52.44)
  Bottom Layer w0.203: U16.1 32.68,51.49 R41.2 v1(32.67,52.44)
ESP_IO46: length 6.6
  Top Layer w0.203: U9.56 v1(47.12,57.17)
  Bottom Layer w0.203: v1(47.12,57.17) 46.33,57.17 43.63,59.87 FPC2.4
ESP_IO47: length 10.1
  Top Layer w0.203: U9.57 v1(47.12,58.02) 42.53,58.02 42.04,57.52 v1(41.02,57.52)
  Bottom Layer w0.203: FPC2.3 40.25,59.57 41.02,58.79 v1(41.02,57.52)
ESP_IO54: length 5.6
  Top Layer w0.203: U9.64 v1(47.12,63.97)
  Bottom Layer w0.203: v1(47.12,63.97) 46.83,64.25 43.18,64.25 42.99,64.07 FPC2.18
ESP_IO57: length 9
  Top Layer w0.203: U9.67 47.14,66.52 v1(47.12,66.54)
  Bottom Layer w0.203: FPC2.21 40.59,64.97 42.16,66.54 v1(47.12,66.54)
ESP_SPI2_CLK: length 10
  Top Layer w0.203: U9.58 v1(47.12,58.87) 42.37,58.87 v1(41.66,58.16)
  Bottom Layer w0.203: v1(41.66,58.16) 41.66,59.04 40.53,60.17 FPC2.5
ESP_SPI2_CS: length 9.3
  Top Layer w0.203: v1(41.5,61.38) 43.17,59.72 v1(47.12,59.72) U9.59
  Bottom Layer w0.203: v1(41.5,61.38) 40.89,60.77 FPC2.7
ESP_SPI2_D0: length 9.1
  Top Layer w0.203: U9.63 47.88,62.98 40.87,62.98 v1(40.84,63.01)
  Bottom Layer w0.203: FPC2.11 40.26,61.97 40.84,62.55 v1(40.84,63.01)
ESP_SPI2_D1: length 5.5
  Top Layer w0.203: 48.02,61.42 v1(47.12,61.42)
  Bottom Layer w0.203: v1(47.12,61.42) 46.87,61.67 FPC2.10
ESP_SPI2_D2: length 8.7
  Top Layer w0.203: v1(41.48,62.27) 41.48,62.27 U9.62
  Bottom Layer w0.203: v1(41.48,62.27) 41.48,62.27 40.87,61.66 40.87,61.66 40.57,61.37 FPC2.9
ESP_SPI2_D3: length 5.6
  Top Layer w0.203: U9.60 v1(47.12,60.57)
  Bottom Layer w0.203: FPC2.8 46.62,61.07 v1(47.12,60.57)
ESP_TF_CLK: length 33.5
  Top Layer w0.203: v1(19.54,65.38) 19.54,65.39 CARD2.5 ; v1(33.06,47.57) 33.06,49.25 U9.31
  SINGAL w0.203: v1(19.54,65.38) 18.03,63.87 18.03,54.09 25.27,46.85 32.34,46.85 v1(33.06,47.57)
ESP_TF_CMD: length 33.7
  Top Layer w0.203: v1(33.91,50.15) 33.91,49.28 U9.32 ; R39.2 20.6,63.19 v1(19.58,63.19) CARD2.3
  SINGAL w0.203: v1(33.91,50.15) 33.15,49.39 27.43,49.39 25.84,50.99 arc(25.76,51.17) 25.84,51.35 25.94,51.45 arc(25.94,51.81) 25.58,51.81 25.48,51.7 arc(25.12,51.7) 25.12,52.06 25.22,52.17 arc(25.22,52.53) 24.86,52.53 24.76,52.42 arc(24.4,52.42) 24.4,52.78 24.5,52.88 arc(24.5,53.24) 24.15,53.24 24.04,53.14 arc(23.68,53.14) 23.68,53.5 23.79,53.6 arc(23.79,53.96) 23.43,53.96 23.32,53.86 arc(22.97,53.86) 22.97,54.22 23.07,54.32 arc(23.07,54.68) 22.71,54.68 22.61,54.58 arc(22.25,54.58) 22.25,54.94 22.35,55.04 arc(22.35,55.4) 21.99,55.4 21.89,55.3 arc(21.53,55.3) 21.53,55.66 21.63,55.76 arc(21.63,56.12) 21.27,56.12 21.17,56.01 arc(20.99,55.94) 20.81,56.01 20.45,56.38 20.45,62.32 v1(19.58,63.19)
ESP_TF_DAT0: length 33.3
  Top Layer w0.203: v1(29.59,50.4) 29.59,49.33 U9.27 ; R38.2 20.62,67.59 v1(19.56,67.59) CARD2.7
  SINGAL w0.203: v1(19.56,67.59) 22.22,64.92 22.22,58.03 22.49,57.76 arc(22.67,57.69) 22.85,57.76 23,57.91 arc(23.36,57.91) 23.36,57.55 23.21,57.4 arc(23.21,57.04) 23.57,57.04 23.72,57.19 arc(24.08,57.19) 24.08,56.83 23.93,56.68 arc(23.93,56.32) 24.29,56.32 24.44,56.47 arc(24.8,56.47) 24.8,56.11 24.65,55.96 arc(24.65,55.61) 25.01,55.61 25.16,55.75 arc(25.52,55.75) 25.52,55.39 25.37,55.25 arc(25.37,54.89) 25.73,54.89 25.88,55.04 arc(26.23,55.04) 26.23,54.68 26.09,54.53 arc(26.09,54.17) 26.44,54.17 26.59,54.32 arc(26.95,54.32) 26.95,53.96 26.8,53.81 arc(26.8,53.45) 27.16,53.45 27.31,53.6 arc(27.67,53.6) 27.67,53.24 27.52,53.09 arc(27.52,52.73) 27.88,52.73 28.03,52.88 arc(28.39,52.88) 28.39,52.52 28.24,52.37 arc(28.17,52.19) 28.24,52.01 29.59,50.67 v1(29.59,50.4)
ESP_TF_DAT1: length 33.3
  Top Layer w0.203: U9.28 30.54,49.32 v1(30.54,50.41) ; CARD2.8 v1(19.56,68.69) 20.77,68.69 R35.2
  SINGAL w0.203: v1(30.54,50.41) 30.54,51.74 29.17,53.12 arc(29.09,53.3) 29.17,53.48 29.31,53.63 arc(29.31,53.99) 28.96,53.99 28.81,53.84 arc(28.45,53.84) 28.45,54.2 28.6,54.35 arc(28.6,54.71) 28.24,54.71 28.09,54.56 arc(27.73,54.56) 27.73,54.92 27.88,55.06 arc(27.88,55.42) 27.52,55.42 27.37,55.28 arc(27.01,55.28) 27.01,55.63 27.16,55.78 arc(27.16,56.14) 26.8,56.14 26.65,55.99 arc(26.29,55.99) 26.29,56.35 26.44,56.5 arc(26.44,56.86) 26.08,56.86 25.93,56.71 arc(25.57,56.71) 25.57,57.07 25.72,57.22 arc(25.72,57.58) 25.36,57.58 25.21,57.43 arc(25.03,57.36) 24.86,57.43 24.18,58.1 arc(24.12,58.26) 24.18,58.42 arc(24.25,58.58) 24.18,58.74 24.14,58.78 arc(23.98,58.85) 23.82,58.78 arc(23.66,58.71) 23.51,58.78 23.11,59.17 23.11,65.13 v1(19.56,68.69)
ESP_TF_DAT2: length 33.1
  Top Layer w0.203: U9.29 31.37,49.24 v1(31.37,48.38) ; R36.2 20.61,60.99 v1(19.59,60.99) CARD2.1
  SINGAL w0.203: v1(31.37,48.38) 26.54,48.38 26.5,48.42 arc(26.43,48.6) 26.5,48.78 26.65,48.93 arc(26.65,49.29) 26.29,49.29 26.14,49.14 arc(25.78,49.14) 25.78,49.5 25.93,49.64 arc(25.93,50) 25.57,50 25.42,49.85 arc(25.06,49.85) 25.06,50.21 25.21,50.36 arc(25.21,50.72) 24.85,50.72 24.71,50.57 arc(24.35,50.57) 24.35,50.93 24.5,51.08 arc(24.5,51.44) 24.14,51.44 23.99,51.29 arc(23.63,51.29) 23.63,51.65 23.78,51.8 arc(23.78,52.16) 23.42,52.16 23.27,52.01 arc(22.91,52.01) 22.91,52.37 23.06,52.52 arc(23.06,52.88) 22.7,52.88 22.55,52.73 arc(22.19,52.73) 22.19,53.09 22.34,53.24 arc(22.34,53.6) 21.98,53.6 21.83,53.45 arc(21.47,53.45) 21.47,53.81 21.62,53.95 arc(21.62,54.31) 21.26,54.31 21.11,54.17 arc(20.75,54.17) 20.75,54.52 20.9,54.67 arc(20.9,55.03) 20.54,55.03 20.4,54.88 arc(20.22,54.81) 20.04,54.88 19.59,55.33 v1(19.59,60.99)
ESP_TF_DAT3: length 33.2
  Top Layer w0.203: R37.2 20.77,62.09 v1(19.56,62.09) CARD2.2 ; v1(32.26,48.38) 32.26,49.2 U9.30
  SINGAL w0.203: v1(19.56,62.09) 18.8,61.32 18.8,54.47 19.95,53.32 arc(20.13,53.24) 20.31,53.32 20.4,53.4 arc(20.76,53.4) 20.76,53.04 20.67,52.96 arc(20.67,52.6) 21.03,52.6 21.12,52.68 arc(21.48,52.68) 21.48,52.32 21.39,52.24 arc(21.39,51.88) 21.75,51.88 21.84,51.96 arc(22.19,51.96) 22.19,51.6 22.11,51.52 arc(22.11,51.16) 22.47,51.16 22.55,51.25 arc(22.91,51.25) 22.91,50.89 22.83,50.8 arc(22.83,50.44) 23.19,50.44 23.27,50.53 arc(23.63,50.53) 23.63,50.17 23.55,50.08 arc(23.55,49.72) 23.91,49.72 23.99,49.81 arc(24.35,49.81) 24.35,49.45 24.26,49.36 arc(24.19,49.18) 24.26,49 25.65,47.61 31.62,47.61 32.26,48.25 v1(32.26,48.38)
ESP_USB_DN: length 34.1
  Top Layer w0.203: U17.6 25.89,22.58 28.45,25.14 28.45,35.8 41.54,48.9 U9.41
ESP_USB_DP: length 33.9
  Top Layer w0.203: U17.7 25.39,22.84 27.81,25.26 27.81,35.93 40.69,48.81 U9.40
GBAT: length 10.8
  Top Layer w0.203: R1.1 42.93,32.29 42.93,34.91 43.36,35.35 R34.1 44.34,35.87 U14.6
LCD_LEDK: length 8.3
  PWR w0.203: v1(42.49,57.01) 37.64,52.16 v1(36.86,52.16)
  Bottom Layer w0.203: U16.5 v1(36.86,52.16)
PWR_3V3_EN: length 15.4
  Top Layer w0.203: U4.1 41.69,28.46 R5.2 40.95,29.88 v1(40.56,30.27) ; U6.5 v1(34.93,23.23)
  Bottom Layer w0.203: v1(40.56,30.27) 40.56,25.82 37.97,23.23 v1(34.93,23.23)
TYPEC_USB_DN: length 10.1
  Top Layer w0.254: 25.39,17.33 25.39,13.92 arc(25.47,13.74) 25.65,13.67 25.91,13.67 arc(26.16,13.42) 25.91,13.16 25.65,13.16 arc(25.39,12.91) 25.65,12.65 25.91,12.65 arc(26.16,12.4) 25.91,12.15 25.65,12.15 arc(25.47,12.07) 25.39,11.89 25.39,10.79 25.85,10.34 D1.4
TYPEC_USB_DN_IN: length 13.6
  Top Layer w0.254: USB1.A7 36.7,7.36 36.19,7.86 v1(35.7,7.86) USB1.B7 ; D1.3 30.01,10.34 v1(30.58,9.77)
  Bottom Layer w0.254: v1(35.7,7.86) 33.79,9.77 33.4,9.77 arc(33.22,9.84) 33.15,10.02 33.15,10.28 arc(32.89,10.53) 32.64,10.28 32.64,10.02 arc(32.38,9.77) 32.13,10.02 32.13,10.28 arc(31.88,10.53) 31.62,10.28 31.62,10.02 arc(31.55,9.84) 31.37,9.77 v1(30.58,9.77)
TYPEC_USB_DP: length 10
  Top Layer w0.254: 24.89,17.33 24.89,9.39 25.84,8.44 D1.6
TYPEC_USB_DP_IN: length 13.7
  Top Layer w0.254: USB1.A6 v1(36.2,4.94) 36.7,4.94 37.2,5.44 USB1.B6 ; v1(30.61,8.88) 30.16,8.44 D1.1
  Bottom Layer w0.254: v1(30.61,8.88) 33.66,8.88 36.2,6.34 v1(36.2,4.94)
$2N13: length 5
  Top Layer w0.203: C11.1 34.25,16.16 34.67,15.74 35.69,15.74 37.13,14.29 U3.21
$2N16: length 15.6
  Top Layer w0.203: R13.1 v1(46.48,15.43) ; C9.1 35.56,14.72 v1(35.96,14.33) 36.49,13.79 U3.22
  SINGAL w0.203: v1(35.96,14.33) 37.5,15.86 46.05,15.86 v1(46.48,15.43)
$2N18: length 5.5
  Top Layer w0.203: R10.2 R14.2 R13.2 44.17,14.79 U3.11
$2N19: length 2.8
  Top Layer w0.203: U3.10 44.67,14.29 R9.2
$2N86: length 3.3
  Top Layer w0.203: R4.1 R3.2 42.25,25.52 U4.5
$2N133: length 1.6
  Top Layer w0.203: R33.1 45.34,35.6 U14.8
$2N135: length 1.3
  Top Layer w0.203: R33.2 R34.2
$2N157: length 1.7
  Top Layer w0.203: 48.01,36.89 47.93,36.82 U14.10
$3N1: length 12.2
  Top Layer w0.203: U2.36 12.5,25.08 11.43,26.15 6.8,26.15 X1.1 6.11,27.78 C32.2
$3N2: length 9.2
  Top Layer w0.203: C33.1 7.37,25.09 X1.3 7.87,25.64 11.3,25.64 12.1,24.85 U2.37
$3N20: length 4.8
  Top Layer w0.203: U2.9 7.43,18.91 7.37,18.97 C19.1
$3N22: length 8.3
  Top Layer w0.203: U2.23 15.73,19.31 16.93,18.11 C24.2 17.4,17.9 18.03,17.26 19.18,17.26 19.69,16.75 19.69,15.36 19.3,14.98 C25.2
$3N23: length 4.2
  Top Layer w0.203: U2.20 17.33,14.98 C25.1
$3N24: length 2.4
  Top Layer w0.203: U2.24 16.04,19.71 16.55,19.2 C24.1
$3N25: length 1.8
  Top Layer w0.203: U2.18 13.7,17.06 C22.1
$3N26: length 3.1
  Top Layer w0.203: U2.21 17.08,16.63 C21.1
$3N29: length 2.8
  Top Layer w0.203: U2.10 10.2,17.21 C20.1
$3N30: length 2
  Top Layer w0.203: U2.11 10.9,16.82 10.2,16.12
$3N32: length 2.9
  Top Layer w0.203: 7.37,20.37 7.63,20.11 U2.6
$3N34: length 5.2
  Top Layer w0.203: U2.5 8.69,20.51 8,21.2 6.41,21.2 5.59,20.37
$3N63: length 1.6
  Top Layer w0.203: U7.7 U7.8 9.37,36.61 R17.1
$3N69: length 10.6
  Top Layer w0.203: U2.14 12.1,16.75
  Top Layer w0.508: CN1.3 9.59,9.33 12.1,11.84 12.1,16.75
$3N70: length 13.3
  Top Layer w0.203: U2.16 12.9,16.75
  Top Layer w0.508: 12.9,16.75 12.9,10.84 15.66,8.07 CN1.6
$5N6: length 1.7
  Top Layer w0.203: U11.1 46,9.2 46.1,9.3
  Top Layer w0.508: C4.2 46.1,9.3
$5N15: length 23.4
  Top Layer w0.203: U11.6 42.93,4.5 ; 45.94,4.52 45.48,4.52 U11.10
  Top Layer w0.508: 42.93,4.5 v1(42.54,4.5) ; v1(40.51,8.25) 41.46,8.25 L3.1 ; 45.94,4.52 C5.2 C58.2 v1(48.26,3.55)
  PWR w0.508: v1(40.51,8.25) 46.74,8.25 48.26,6.72 v1(48.26,3.55) 47.31,4.5 v1(42.54,4.5)
$6N45: length 12.6
  Top Layer w0.203: R32.2 29.28,3.29 37.08,3.29 38.2,4.41 USB1.B5
$6N46: length 7
  Top Layer w0.203: USB1.A5 35.2,4.96 34.37,4.13 R31.2
$6N67: length 2.3
  Top Layer w0.203: U12.6 24.92,24.64 24.52,24.25 C38.1
$7N55: length 1.5
  Top Layer w0.203: C54.1 U1.9

## Copper pours and planes (outline as drawn; the poured copper is in the pictures)
GND on Top Layer: -8.13,83.43 58.29,83.43 58.29,-11.44 -8.13,-11.44
GND on Bottom Layer: -5.33,83.43 55.37,83.43 55.37,-6.23 -5.33,-6.23
GND on GND1: -6.22,91.56 60.2,91.56 60.2,-3.31 -6.22,-3.31
GND on PWR: 0,30.72 5.6,30.72 9.4,26.91 15.37,26.91 17.65,24.63 17.65,0 0,0
GND on SINGAL: -21.46,91.81 102.24,91.81 102.24,-28.08 -21.46,-28.08
GND on GND2: -11.44,83.29 54.98,83.29 54.98,-11.58 -11.44,-11.58
VBAT on Top Layer: 41.19,20.14 42.47,20.14 42.47,15.64 41.19,15.64
VBAT on Top Layer: 40.7,20.86 42.48,20.86 42.48,15.64 40.7,15.64
VBAT on Top Layer: 41.17,21.33 47.62,21.33 47.62,15.63 41.17,15.63
VBUS_5V on Top Layer: 33.78,12.44 39.12,12.44 39.12,5.83 33.78,5.83
VCC on Top Layer: 39.22,20.52 40.47,20.52 40.47,15.63 39.22,15.63
VCC on Top Layer: 33.02,20.66 40.46,20.66 40.46,18.94 33.02,18.94
VCC_3V3 on Top Layer: 36.07,31.21 37.34,31.21 37.34,26.13 36.07,26.13
VCC_LCD_BG on Top Layer: 31,13.53 38.47,13.53 38.47,11.97 31,11.97
GBAT on Top Layer: 45.34,29.2 47.94,29.2 47.94,24.49 45.34,24.49
LCD_LEDA on Bottom Layer: 35.43,59.15 40.21,59.15 40.21,54.47 35.43,54.47
LCD_LEDK on Bottom Layer: 42.16,59.44 44.64,59.44 44.64,56.12 42.16,56.12
MOTOR_OUT_N on Top Layer: 44.8,5.17 46.99,5.17 46.99,0.75 44.8,0.75
MOTOR_OUT_P on Top Layer: 42.29,5.2 44.32,5.2 44.32,0.75 42.29,0.75
$2N14 on Top Layer: 31.02,18.4 36.07,18.4 36.07,15.69 31.02,15.69
$2N14 on Top Layer: 34.8,18.4 38.47,18.4 38.47,14.67 34.8,14.67
$2N84 on Top Layer: 37.72,28.31 40.16,28.31 40.16,26.25 37.72,26.25
$4N41 on Bottom Layer: 33.66,56.25 34.93,56.25 34.93,53.06 33.66,53.06
